# Altium schematic sheet button.SchDoc
size B
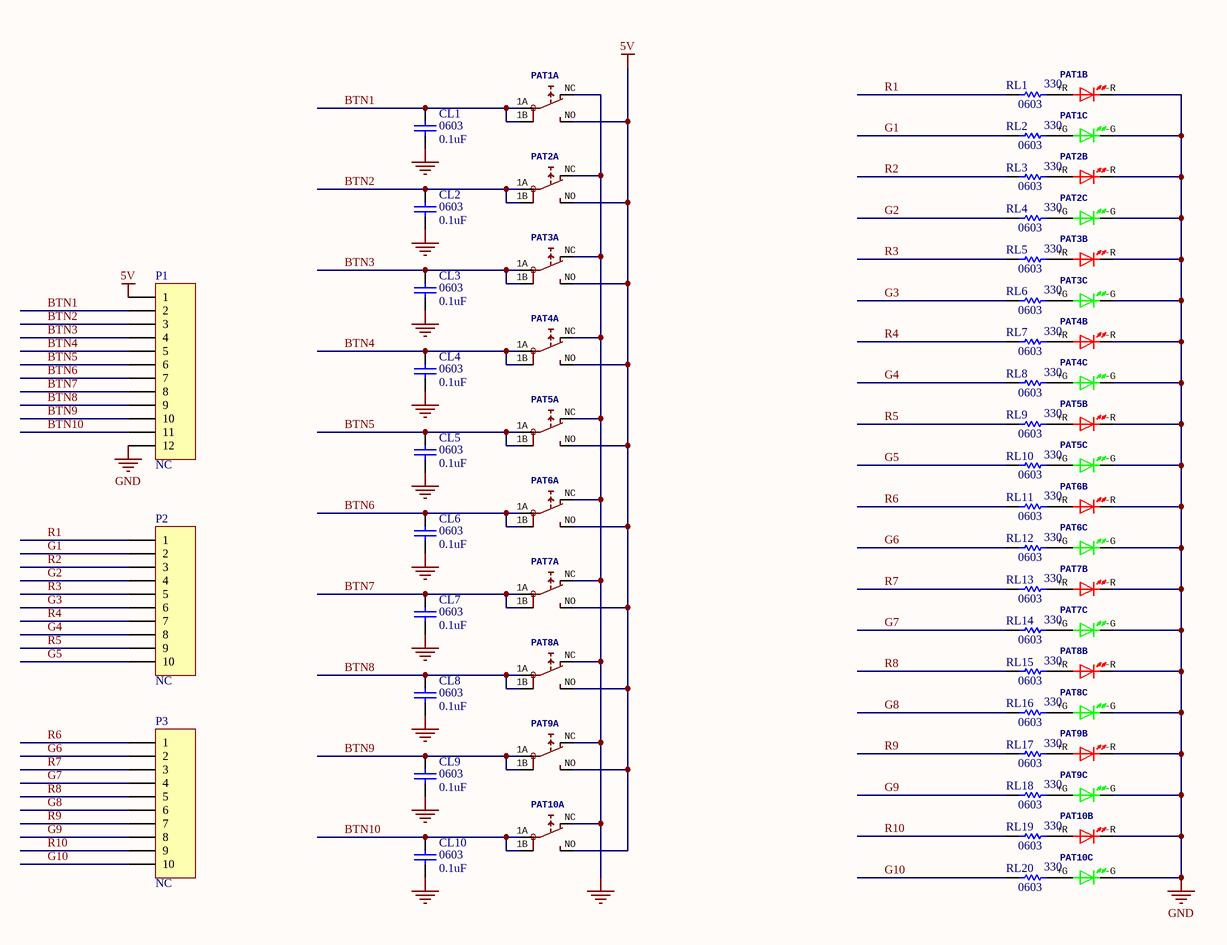
[diagram p0: button.SchDoc]

## Parts
CL1  0603  value 0.1uF  [C0603]
CL2  0603  value 0.1uF  [C0603]
CL3  0603  value 0.1uF  [C0603]
CL4  0603  value 0.1uF  [C0603]
CL5  0603  value 0.1uF  [C0603]
CL6  0603  value 0.1uF  [C0603]
CL7  0603  value 0.1uF  [C0603]
CL8  0603  value 0.1uF  [C0603]
CL9  0603  value 0.1uF  [C0603]
CL10  0603  value 0.1uF  [C0603]
P1  NC  [12P HEADER]
P2  NC  [10P HEADER]
P3  NC  [10P HEADER]
PAT1  55?-2LED01  [5501-2LED]  (value not drawn)  (parts A,B,C of 3)
PAT2  55?-2LED01  [5501-2LED]  (value not drawn)  (parts A,B,C of 3)
PAT3  55?-2LED01  [5501-2LED]  (value not drawn)  (parts A,B,C of 3)
PAT4  55?-2LED01  [5501-2LED]  (value not drawn)  (parts A,B,C of 3)
PAT5  55?-2LED01  [5501-2LED]  (value not drawn)  (parts A,B,C of 3)
PAT6  55?-2LED01  [5501-2LED]  (value not drawn)  (parts A,B,C of 3)
PAT7  55?-2LED01  [5501-2LED]  (value not drawn)  (parts A,B,C of 3)
PAT8  55?-2LED01  [5501-2LED]  (value not drawn)  (parts A,B,C of 3)
PAT9  55?-2LED01  [5501-2LED]  (value not drawn)  (parts A,B,C of 3)
PAT10  55?-2LED01  [5501-2LED]  (value not drawn)  (parts A,B,C of 3)
RL1  0603  value 330  [R0603]
RL2  0603  value 330  [R0603]
RL3  0603  value 330  [R0603]
RL4  0603  value 330  [R0603]
RL5  0603  value 330  [R0603]
RL6  0603  value 330  [R0603]
RL7  0603  value 330  [R0603]
RL8  0603  value 330  [R0603]
RL9  0603  value 330  [R0603]
RL10  0603  value 330  [R0603]
RL11  0603  value 330  [R0603]
RL12  0603  value 330  [R0603]
RL13  0603  value 330  [R0603]
RL14  0603  value 330  [R0603]
RL15  0603  value 330  [R0603]
RL16  0603  value 330  [R0603]
RL17  0603  value 330  [R0603]
RL18  0603  value 330  [R0603]
RL19  0603  value 330  [R0603]
RL20  0603  value 330  [R0603]

## Nets
5V: P1.1 PAT1.NO PAT2.NO PAT3.NO PAT4.NO PAT5.NO PAT6.NO PAT7.NO PAT8.NO PAT9.NO PAT10.NO
GND: CL1.1 CL2.1 CL3.1 CL4.1 CL5.1 CL6.1 CL7.1 CL8.1 CL9.1 CL10.1 P1.12 PAT1.-G(K) PAT1.-R(K) PAT1.NC PAT2.-G(K) PAT2.-R(K) PAT2.NC PAT3.-G(K) PAT3.-R(K) PAT3.NC PAT4.-G(K) PAT4.-R(K) PAT4.NC PAT5.-G(K) PAT5.-R(K) PAT5.NC PAT6.-G(K) PAT6.-R(K) PAT6.NC PAT7.-G(K) PAT7.-R(K) PAT7.NC PAT8.-G(K) PAT8.-R(K) PAT8.NC PAT9.-G(K) PAT9.-R(K) PAT9.NC PAT10.-G(K) PAT10.-R(K) PAT10.NC
BTN1: CL1.2 P1.2 PAT1.1A PAT1.1B
BTN2: CL2.2 P1.3 PAT2.1A PAT2.1B
BTN3: CL3.2 P1.4 PAT3.1A PAT3.1B
BTN4: CL4.2 P1.5 PAT4.1A PAT4.1B
BTN5: CL5.2 P1.6 PAT5.1A PAT5.1B
BTN6: CL6.2 P1.7 PAT6.1A PAT6.1B
BTN7: CL7.2 P1.8 PAT7.1A PAT7.1B
BTN8: CL8.2 P1.9 PAT8.1A PAT8.1B
BTN9: CL9.2 P1.10 PAT9.1A PAT9.1B
BTN10: CL10.2 P1.11 PAT10.1A PAT10.1B
G1: P2.2 RL2.1
G2: P2.4 RL4.1
G3: P2.6 RL6.1
G4: P2.8 RL8.1
G5: P2.10 RL10.1
G6: P3.2 RL12.1
G7: P3.4 RL14.1
G8: P3.6 RL16.1
G9: P3.8 RL18.1
G10: P3.10 RL20.1
R1: P2.1 RL1.1
R2: P2.3 RL3.1
R3: P2.5 RL5.1
R4: P2.7 RL7.1
R5: P2.9 RL9.1
R6: P3.1 RL11.1
R7: P3.3 RL13.1
R8: P3.5 RL15.1
R9: P3.7 RL17.1
R10: P3.9 RL19.1
NetPAT1_+G: PAT1.+G(A) RL2.2
NetPAT1_+R: PAT1.+R(A) RL1.2
NetPAT2_+G: PAT2.+G(A) RL4.2
NetPAT2_+R: PAT2.+R(A) RL3.2
NetPAT3_+G: PAT3.+G(A) RL6.2
NetPAT3_+R: PAT3.+R(A) RL5.2
NetPAT4_+G: PAT4.+G(A) RL8.2
NetPAT4_+R: PAT4.+R(A) RL7.2
NetPAT5_+G: PAT5.+G(A) RL10.2
NetPAT5_+R: PAT5.+R(A) RL9.2
NetPAT6_+G: PAT6.+G(A) RL12.2
NetPAT6_+R: PAT6.+R(A) RL11.2
NetPAT7_+G: PAT7.+G(A) RL14.2
NetPAT7_+R: PAT7.+R(A) RL13.2
NetPAT8_+G: PAT8.+G(A) RL16.2
NetPAT8_+R: PAT8.+R(A) RL15.2
NetPAT9_+G: PAT9.+G(A) RL18.2
NetPAT9_+R: PAT9.+R(A) RL17.2
NetPAT10_+G: PAT10.+G(A) RL20.2
NetPAT10_+R: PAT10.+R(A) RL19.2

## Library data of the parts
CL1-CL10 = Cap: CAP CER 0.1UF 50V X5R 0603; Manufacturer 1: Yageo; Manufacturer Part Number 1: CC0603KRX5R9BB104; Capacitance: 100nF; Tolerance: 10%; ComponentLink1URL: https://datasheet.ciiva.com/30062/tmk212bbj106kg-t-30062083.pdf?src-supplier=Onlinecomponents.com; ComponentLink1Description: https://datasheet.ciiva.com/30062/tmk212bbj106kg-t-30062083.pdf?src-supplier=Onlinecomponents.com; ComponentLink2URL: https://datasheet.ciiva.com/139/mlcc-all-e-139570.pdf?src-supplier=Digi-Key; ComponentLink2Description: https://datasheet.ciiva.com/139/mlcc-all-e-139570.pdf?src-supplier=Digi-Key; ComponentLink3URL: https://datasheet.ciiva.com/139/mlcc-all-e-139571.pdf?src-supplier=Digi-Key; ComponentLink3Description: https://datasheet.ciiva.com/139/mlcc-all-e-139571.pdf?src-supplier=Digi-Key; ComponentLink4URL: https://datasheet.ciiva.com/139/mlcc-all-e-139572.pdf?src-supplier=Digi-Key; ComponentLink4Description: https://datasheet.ciiva.com/139/mlcc-all-e-139572.pdf?src-supplier=Digi-Key; ComponentLink5URL: https://datasheet.ciiva.com/7975/1481447-7975820.pdf?src-supplier=Element14; ComponentLink5Description: https://datasheet.ciiva.com/7975/1481447-7975820.pdf?src-supplier=Element14; ComponentLink6URL: https://datasheet.ciiva.com/144/mlccorderingcode-144037.pdf?src-supplier=Digi-Key; ComponentLink6Description: https://datasheet.ciiva.com/144/mlccorderingcode-144037.pdf?src-supplier=Digi-Key; ComponentLink7URL: https://datasheet.ciiva.com/8033/1489800-8033669.pdf?src-supplier=Element14; ComponentLink7Description: https://datasheet.ciiva.com/8033/1489800-8033669.pdf?src-supplier=Element14; ComponentLink8URL: https://datasheet.ciiva.com/15189/getdatasheetpartid-321421-15189125.pdf?src-supplier=Verical; ComponentLink8Description: https://datasheet.ciiva.com/15189/getdatasheetpartid-321421-15189125.pdf?src-supplier=Verical; ComponentLink9URL: https://datasheet.ciiva.com/144/mlccorderingcode-144038.pdf?src-supplier=Digi-Key; ComponentLink9Description: https://datasheet.ciiva.com/144/mlccorderingcode-144038.pdf?src-supplier=Digi-Key; ComponentLink10URL: https://datasheet.ciiva.com/28450/1489800-28450342.pdf?src-supplier=Element14; ComponentLink10Description: https://datasheet.ciiva.com/28450/1489800-28450342.pdf?src-supplier=Element14; ComponentLink11URL: https://datasheet.ciiva.com/144/mlccorderingcode-144039.pdf?src-supplier=Digi-Key; ComponentLink11Description: https://datasheet.ciiva.com/144/mlccorderingcode-144039.pdf?src-supplier=Digi-Key; ComponentLink12URL: https://datasheet.ciiva.com/8033/1489800-8033671.pdf?src-supplier=Element14; ComponentLink12Description: https://datasheet.ciiva.com/8033/1489800-8033671.pdf?src-supplier=Element14; ComponentLink13URL: http://www.farnell.com/datasheets/1872206.pdf?src-supplier=Farnell; ComponentLink13Description: http://www.farnell.com/datasheets/1872206.pdf?src-supplier=Farnell; ComponentLink14URL: http://uk.rs-online.com/webdocs/144c/0900766b8144c113.pdf?src-supplier=RSComponents; ComponentLink14Description: http://uk.rs-online.com/webdocs/144c/0900766b8144c113.pdf?src-supplier=RSComponents; ComponentLink15URL: http://www.farnell.com/datasheets/2048008.pdf?src-supplier=Farnell; ComponentLink15Description: http://www.farnell.com/datasheets/2048008.pdf?src-supplier=Farnell; ComponentLink16URL: http://www.mouser.com/ds/2/281/c02e-2905.pdf?src-supplier=Mouser; ComponentLink16Description: http://www.mouser.com/ds/2/281/c02e-2905.pdf?src-supplier=Mouser; ComponentLink17URL: http://components.arrow.com/part/dataview/0323_06361249?src-supplier=Arrow+Europe; ComponentLink17Description: http://components.arrow.com/part/dataview/0323_06361249?src-supplier=Arrow+Europe; ComponentLink18URL: https://search.murata.co.jp/Ceramy/image/img/A01X/G101/ENG/GRM155R71E104KE14-01.pdf?src-supplier=Digi-Key; ComponentLink18Description: https://search.murata.co.jp/Ceramy/image/img/A01X/G101/ENG/GRM155R71E104KE14-01.pdf?src-supplier=Digi-Key; ComponentLink19URL: http://www.farnell.com/datasheets/2048008.pdf?src-supplier=Newark; ComponentLink19Description: http://www.farnell.com/datasheets/2048008.pdf?src-supplier=Newark; ComponentLink20URL: http://psearch.en.murata.com/capacitor/product/GRM155R71E104KE14%23.pdf?src-supplier=Avnet; ComponentLink20Description: http://psearch.en.murata.com/capacitor/product/GRM155R71E104KE14%23.pdf?src-supplier=Avnet; ComponentLink21URL: http://www.farnell.com/datasheets/2048008.pdf?src-supplier=Element14; ComponentLink21Description: http://www.farnell.com/datasheets/2048008.pdf?src-supplier=Element14; Supplier 1: Digi-Key; Supplier Part Number 1: 311-4046-1-ND; Stock 1: 3816; Pricing 1: 1=0.10000, 10=0.05600, 50=0.03080, 100=0.02510, 500=0.01794, 1000=0.01410 (USD); RoHS: Yes; Mount: Surface Mount; Case/Package: 0603; Case Code (Imperial): 0603; Case Code (Metric): 1608; Weight: 7.1E-05oz; Min Operating Temperature: -55°C; Max Operating Temperature: 85°C; Packaging: Tape and Reel; Voltage Rating: 50V; Dielectric: X5R; Termination: SMD/SMT; Voltage Rating (DC): 50V; Package Quantity: 4000; Length: 0.063inch; Width: 0.031inch; Thickness: 0.035inch; Lead Free: Lead Free; Halogen Free: Halogen Free; ComponentLink22URL: http://www.mouser.com/ds/2/447/Yageo_UPY-GP_NP0_16V-to-50V_9-358835.pdf?src-supplier=Mouser; ComponentLink22Description: http://www.mouser.com/ds/2/447/Yageo_UPY-GP_NP0_16V-to-50V_9-358835.pdf?src-supplier=Mouser; ComponentLink23URL: http://www.yageo.com/documents/recent/UPY-GPHC_X5R_4V-to-50V_25.pdf?src-supplier=Digi-Key; ComponentLink23Description: http://www.yageo.com/documents/recent/UPY-GPHC_X5R_4V-to-50V_25.pdf?src-supplier=Digi-Key; ComponentLink24URL: http://www.yageo.com/exep/pages/download/literatures/ProductSelectionGuide%202014_Final_2.pdf?src-supplier=Digi-Key; ComponentLink24Description: http://www.yageo.com/exep/pages/download/literatures/ProductSelectionGuide%202014_Final_2.pdf?src-supplier=Digi-Key
P1 = Header 12: Header, 12-Pin; LatestRevisionDate: 17-Jul-2002; LatestRevisionNote: Re-released for DXP Platform.; Publisher: Altium Limited
P2 P3 = Header 10: Header, 10-Pin; LatestRevisionDate: 17-Jul-2002; LatestRevisionNote: Re-released for DXP Platform.; Publisher: Altium Limited
PAT1-PAT10 = 5501MBLKREDGRN: Pushbutton Switch SPDT Keyswitch, Illuminated Through Hole; Manufacturer 1: E-Switch; Mechanical Life: 500000Cycles; Illumination Type: LED; Actuator Type: Square, Button; Switch Function: On-Mom; Voltage Rating (DC): 12V; Current Rating: 300mA; Supplier 1: Digi-Key; Manufacturer Part Number 1: 5501MBLKREDGRN; Stock 1: 420; Pricing 1: 1=5.08000, 10=4.53000, 25=4.28800, 50=4.13420, 100=3.93620, 250=3.76028, 500=3.43044, 1000=3.25452 (USD); RoHS: Yes; Mount: Through Hole; Min Operating Temperature: -25°C; Max Operating Temperature: 65°C; Packaging: Bulk; Termination: PC Pin; Throw Configuration: SPDT; Package Quantity: 500; ComponentLink1URL: https://datasheet.ciiva.com/2870/xr0104p-2870260.pdf?src-supplier=Digi-Key; ComponentLink1Description: https://datasheet.ciiva.com/2870/xr0104p-2870260.pdf?src-supplier=Digi-Key; Supplier Part Number 1: EG171571-ND
RL1-RL20 = Res1: RES SMD 330 OHM 1% 1/10W 0603; Manufacturer 1: Yageo; Manufacturer Part Number 1: RC0603FR-07330RL; Max Power Dissipation: 100mW; Temperature Coefficient: 100ppm/°C; Voltage Rating (DC): 50V; Resistance: 330R; ComponentLink1URL: https://datasheet.ciiva.com/11819/0900766b80c66297-11819490.pdf?src-supplier=RSComponents; ComponentLink1Description: https://datasheet.ciiva.com/11819/0900766b80c66297-11819490.pdf?src-supplier=RSComponents; ComponentLink2URL: https://datasheet.ciiva.com/7849/1018594-7849962.pdf?src-supplier=Element14; ComponentLink2Description: https://datasheet.ciiva.com/7849/1018594-7849962.pdf?src-supplier=Element14; ComponentLink3URL: https://datasheet.ciiva.com/17083/pyu-rc0402-51-rohs-l-6-r-17083994.pdf?src-supplier=Future+Electronics; ComponentLink3Description: https://datasheet.ciiva.com/17083/pyu-rc0402-51-rohs-l-6-r-17083994.pdf?src-supplier=Future+Electronics; ComponentLink4URL: https://datasheet.ciiva.com/7849/1018594-7849963.pdf?src-supplier=Element14; ComponentLink4Description: https://datasheet.ciiva.com/7849/1018594-7849963.pdf?src-supplier=Element14; ComponentLink5URL: https://datasheet.ciiva.com/2453/pyu-r-int-thick-7-2453661.pdf?src-supplier=Digi-Key; ComponentLink5Description: https://datasheet.ciiva.com/2453/pyu-r-int-thick-7-2453661.pdf?src-supplier=Digi-Key; ComponentLink6URL: https://datasheet.ciiva.com/2453/pyu-r-int-thick-7-2453662.pdf?src-supplier=Digi-Key; ComponentLink6Description: https://datasheet.ciiva.com/2453/pyu-r-int-thick-7-2453662.pdf?src-supplier=Digi-Key; ComponentLink7URL: https://datasheet.ciiva.com/2453/pyu-r-int-thick-7-2453663.pdf?src-supplier=Digi-Key; ComponentLink7Description: https://datasheet.ciiva.com/2453/pyu-r-int-thick-7-2453663.pdf?src-supplier=Digi-Key; ComponentLink8URL: https://datasheet.ciiva.com/12656/pyu-rc0402-51-rohs-l-6-r-12656815.pdf?src-supplier=Mouser; ComponentLink8Description: https://datasheet.ciiva.com/12656/pyu-rc0402-51-rohs-l-6-r-12656815.pdf?src-supplier=Mouser; Supplier 1: Digi-Key; Supplier Part Number 1: 311-330HRCT-ND; Stock 1: 3885547; Pricing 1: 1=0.10000, 10=0.02300, 100=0.00940, 1000=0.00421, 2500=0.00366 (USD); RoHS: Yes; Case/Package: 0603; Number of Pins: 2; Case Code (Metric): 1608; Case Code (Imperial): 0603; Min Operating Temperature: -55°C; Max Operating Temperature: 155°C; Composition: Thick Film; Features: Moisture Resistant; Number of Terminations: 2; Termination: SMD/SMT; Power Rating: 100mW; Tolerance: 1%; Voltage Rating: 50V; Packaging: Tape and Reel; Package Quantity: 1; Length: 1.6mm; Height: 0.45mm; Depth: 0.8mm; Width: 0.8mm; Lead Free: Lead Free; REACH SVHC: No SVHC; ComponentLink9URL: https://datasheet.ciiva.com/11819/0900766b80f96399-11819327.pdf?src-supplier=RSComponents; ComponentLink9Description: https://datasheet.ciiva.com/11819/0900766b80f96399-11819327.pdf?src-supplier=RSComponents; ComponentLink10URL: https://datasheet.ciiva.com/2454/pyu-r-int-thick-7-2454864.pdf?src-supplier=Digi-Key; ComponentLink10Description: https://datasheet.ciiva.com/2454/pyu-r-int-thick-7-2454864.pdf?src-supplier=Digi-Key; ComponentLink11URL: https://datasheet.ciiva.com/2454/pyu-r-int-thick-7-2454865.pdf?src-supplier=Digi-Key; ComponentLink11Description: https://datasheet.ciiva.com/2454/pyu-r-int-thick-7-2454865.pdf?src-supplier=Digi-Key; ComponentLink12URL: https://datasheet.ciiva.com/2454/pyu-r-int-thick-7-2454866.pdf?src-supplier=Digi-Key; ComponentLink12Description: https://datasheet.ciiva.com/2454/pyu-r-int-thick-7-2454866.pdf?src-supplier=Digi-Key; ComponentLink13URL: https://datasheet.ciiva.com/12555/rc0603-272842-12555334.pdf?src-supplier=Mouser; ComponentLink13Description: https://datasheet.ciiva.com/12555/rc0603-272842-12555334.pdf?src-supplier=Mouser; ComponentLink14URL: https://datasheet.ciiva.com/46440/1868787-46440904.pdf?src-supplier=Element14; ComponentLink14Description: https://datasheet.ciiva.com/46440/1868787-46440904.pdf?src-supplier=Element14; ComponentLink15URL: https://datasheet.ciiva.com/7746/443971-7746329.pdf?src-supplier=Element14; ComponentLink15Description: https://datasheet.ciiva.com/7746/443971-7746329.pdf?src-supplier=Element14; ComponentLink16URL: https://datasheet.ciiva.com/7746/443971-7746330.pdf?src-supplier=Element14; ComponentLink16Description: https://datasheet.ciiva.com/7746/443971-7746330.pdf?src-supplier=Element14; ComponentLink17URL: https://datasheet.ciiva.com/7746/1686128-7746331.pdf?src-supplier=Element14; ComponentLink17Description: https://datasheet.ciiva.com/7746/1686128-7746331.pdf?src-supplier=Element14